# EasyEDA schematic SCH_meshkey.json
TITLE: MeshKey; REV: 1; Date: 2025-03-23; Sheet: 1/1; Drawn By: jose-d; Company: ---
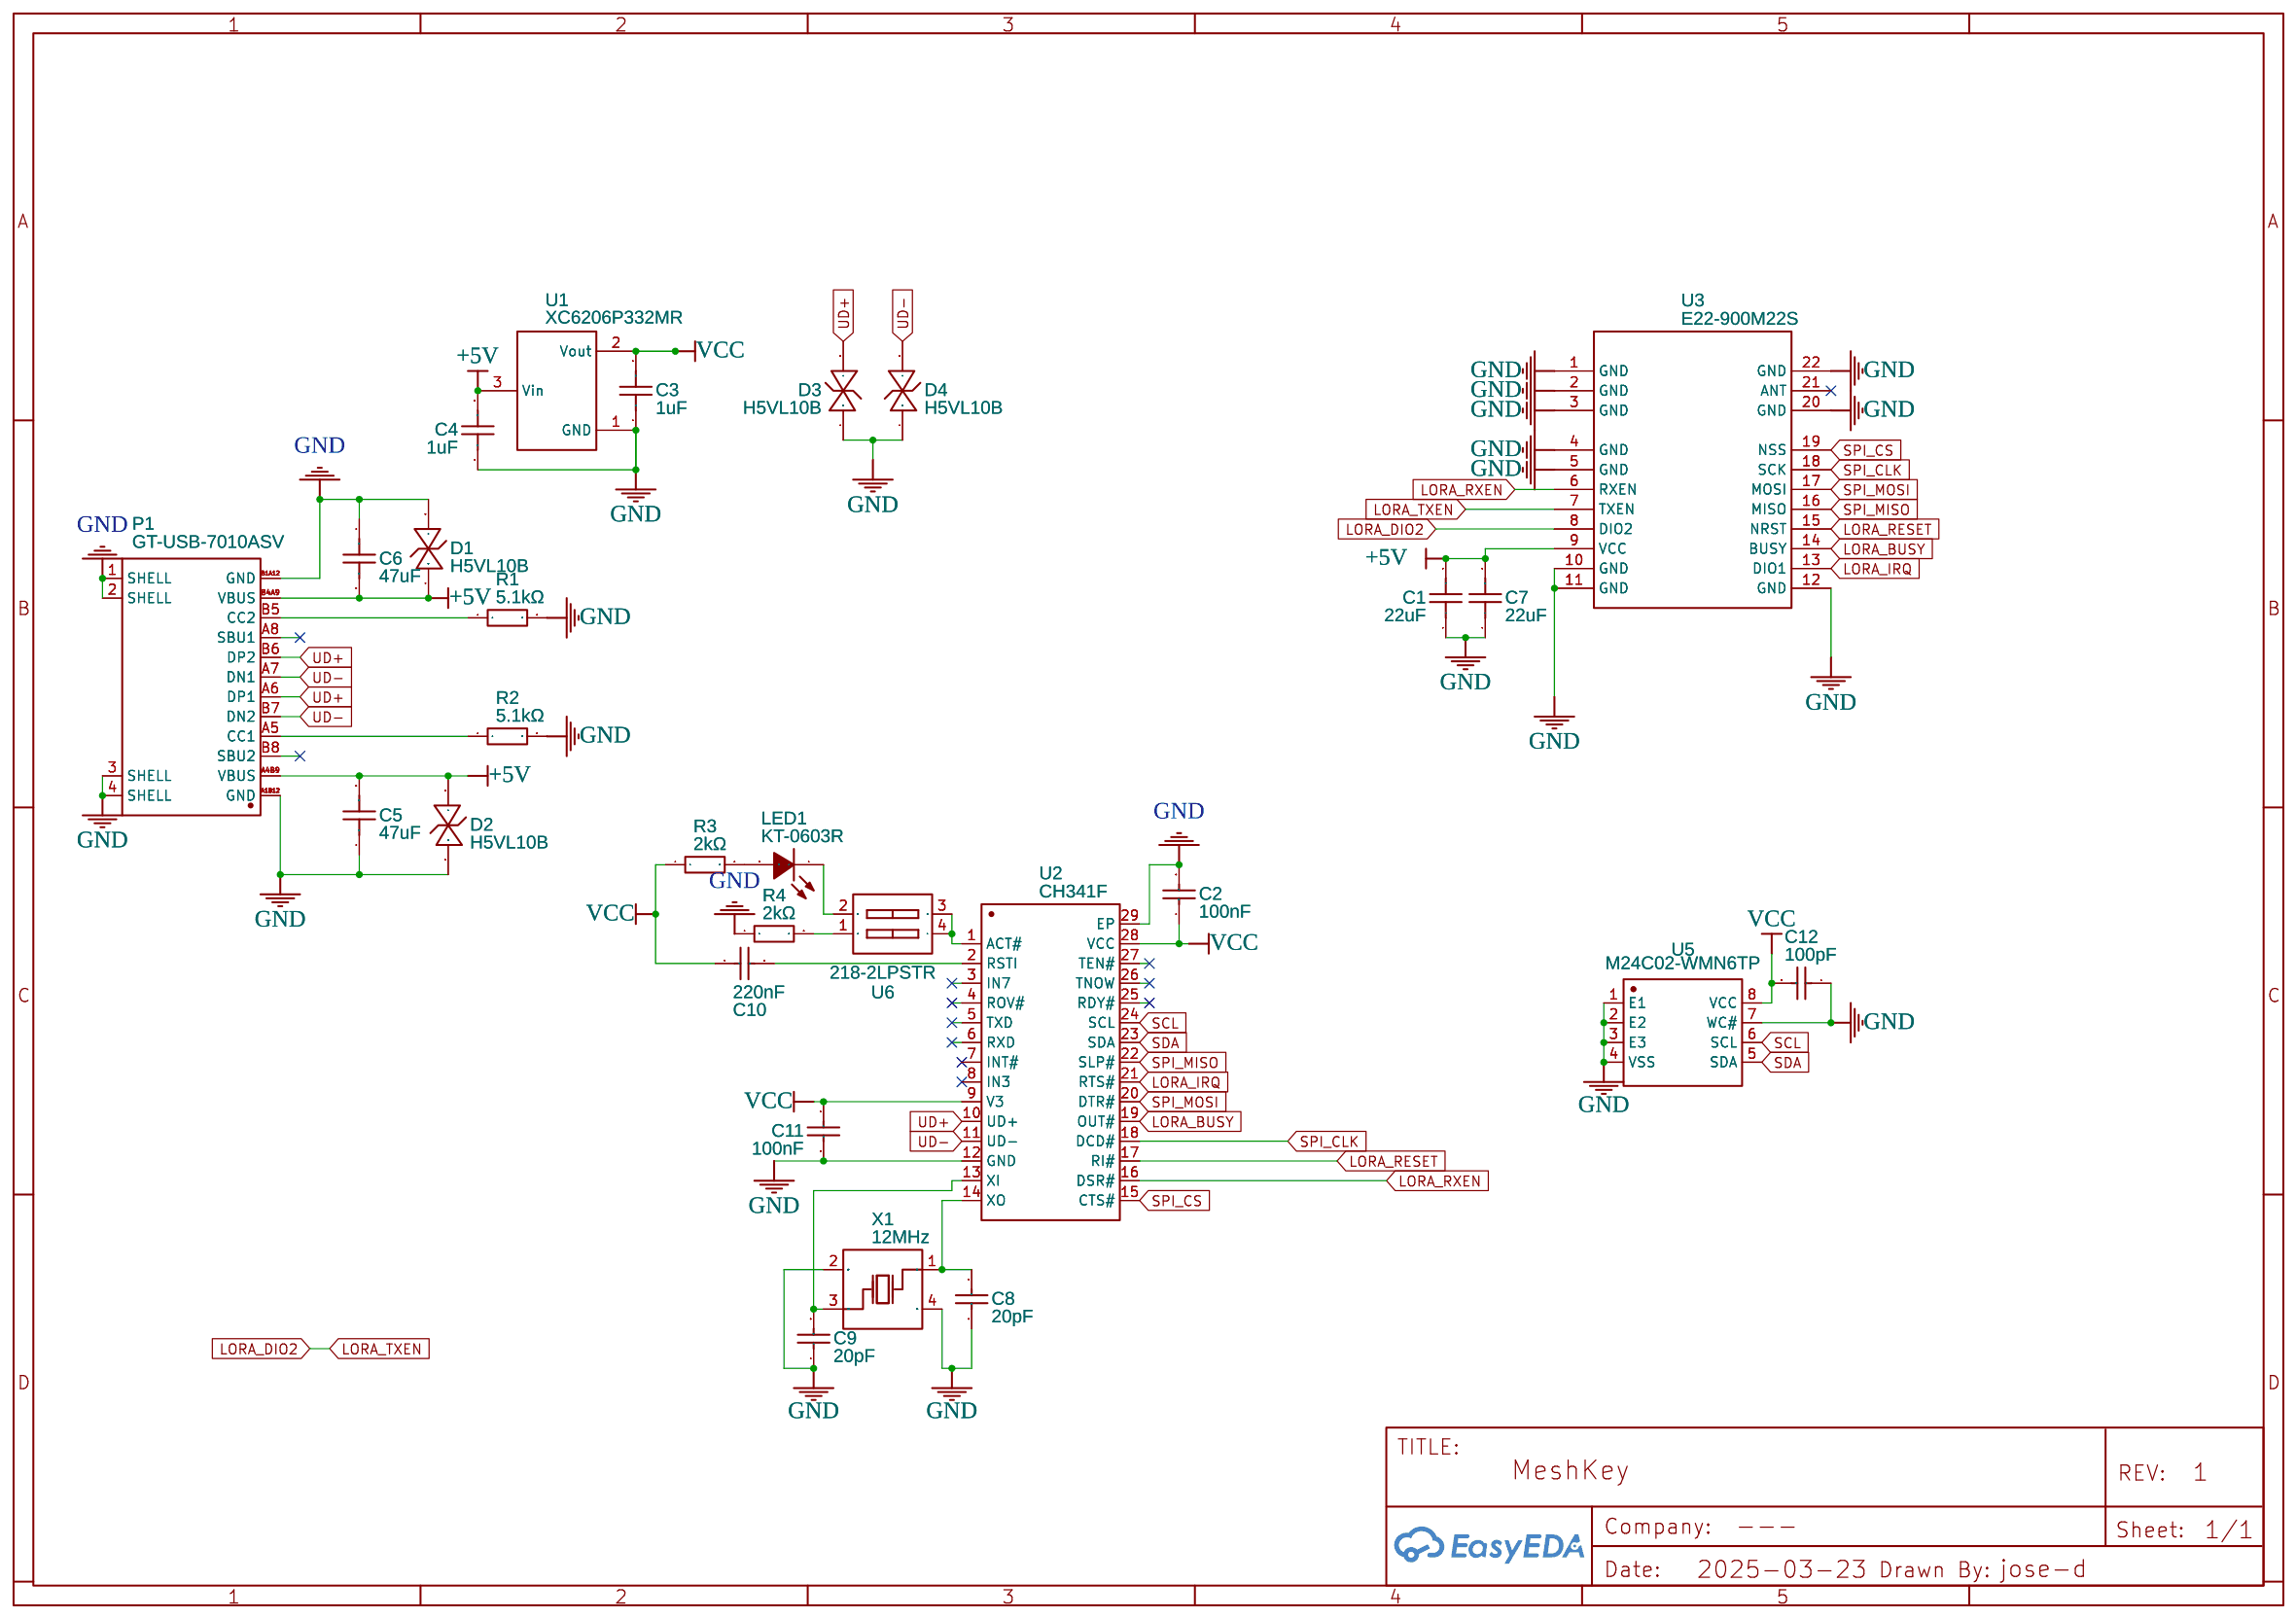
[diagram p0: schematic sheet]

## Parts
C1  22uF  [C0805]
C2  100nF  [C0402]
C3  1uF  [C0603]
C4  1uF  [C0603]
C5  47uF  [C1206]
C6  47uF  [C1206]
C7  22uF  [C0805]
C8  20pF  [C0402]
C9  20pF  [C0402]
C10  220nF  [C0402]
C11  100nF  [C0402]
C12  100pF  [C0402]
D1  H5VL10B  [SOD-882_L1.0-W0.6-BI]
D2  H5VL10B  [SOD-882_L1.0-W0.6-BI]
D3  H5VL10B  [SOD-882_L1.0-W0.6-BI]
D4  H5VL10B  [SOD-882_L1.0-W0.6-BI]
LED1  KT-0603R  [LED0603-RD]
P1  GT-USB-7010ASV  [USB-C-SMD_G-SWITCH_GT-USB-7010ASV]
R1  5.1kΩ  [R0402]
R2  5.1kΩ  [R0402]
R3  2kΩ  [R0402]
R4  2kΩ  [R0402]
U1  XC6206P332MR  [SOT-23-3_L2.9-W1.6-P1.90-LS2.8-BR]
U2  CH341F  [QFN-28_L4.0-W4.0-P0.40-BL-EP]
U3  E22-900M22S  [WIRELM-SMD_E22-900M22S]
U5  M24C02-WMN6TP  [SOIC-8_L4.9-W3.9-P1.27-LS6.0-BL]
U6  218-2LPSTR  [SW-SMD_218-2LPSTRF]
X1  12MHz  [CRYSTAL-SMD_4P-L3.2-W2.5-BL]

## Library data of the parts
C1 C7 = CL21A226MAQNNNE: Supplier: LCSC; Manufacturer: SAMSUNG(三星); Supplier Part: C45783; JLCPCB Part Class: Basic Part
C2 C11 C12 = 0402CG101J500NT: Supplier: LCSC; Manufacturer: FH(风华); Manufacturer Part: CL05B104KO5NNNC; Supplier Part: C1525; JLCPCB Part Class: Basic Part
C3 C4 = CL10A105KB8NNNC: Supplier: LCSC; Manufacturer: SAMSUNG(三星); Supplier Part: C15849; JLCPCB Part Class: Basic Part
C5 C6 = CL31A476MPHNNNE: Supplier: LCSC; Manufacturer: SAMSUNG(三星); Supplier Part: C96123; JLCPCB Part Class: Basic Part
C8 C9 = 0402CG200J500NT: Supplier: LCSC; Manufacturer: FH(风华); Supplier Part: C1554; JLCPCB Part Class: Basic Part
C10 = 0402B471K500NT: Supplier: LCSC; Manufacturer: FH(风华); Manufacturer Part: CL05B224KO5NNNC; Supplier Part: C16772; JLCPCB Part Class: Extended Part
D1-D4 = H5VL10B: Supplier: LCSC; Supplier Part: C7420372; Manufacturer: 宏迦橙; Contributor: lcsc; JLCPCB Part Class: Extended Part
LED1 = KT-0603R: Supplier: LCSC; Manufacturer: KENTO; Supplier Part: C2286; JLCPCB Part Class: Basic Part
P1 = GT-USB-7010ASV: Contributor: lcsc; Supplier: LCSC; Supplier Part: C2988369; Manufacturer: G-Switch(品赞); JLCPCB Part Class: Extended Part
R1 R2 = 0402WGF5101TCE: Supplier: LCSC; Manufacturer: UNI-ROYAL(厚声); Supplier Part: C25905; JLCPCB Part Class: Basic Part
R3 R4 = 0402WGF2001TCE: Supplier: LCSC; Manufacturer: UNI-ROYAL(厚声); Supplier Part: C4109; JLCPCB Part Class: Basic Part
U1 = XC6206P332MR: Supplier: LCSC; Manufacturer: TOREX(特瑞仕); Manufacturer Part: XC6206P332MR-G; Supplier Part: C5446; JLCPCB Part Class: Basic Part
U2 = CH341F: Contributor: LCSC; Supplier: LCSC; Supplier Part: C412870; Manufacturer: WCH(南京沁恒); JLCPCB Part Class: Extended Part
U3 = E22-900M22S: Contributor: LCSC; Supplier: LCSC; Supplier Part: C411293; Manufacturer: EBYTE(亿佰特); JLCPCB Part Class: Extended Part
U5 = M24C02-WMN6TP: Supplier: LCSC; Manufacturer: ST(意法半导体); Supplier Part: C7562; JLCPCB Part Class: Extended Part
U6 = 218-2LPSTR: Contributor: lcsc; Supplier: LCSC; Supplier Part: C2961921; Manufacturer: CTS(西迪斯); JLCPCB Part Class: Extended Part
X1 = X322512MSB4SI: Supplier: LCSC; Manufacturer: YXC(扬兴晶振); Supplier Part: C9002; JLCPCB Part Class: Basic Part

## Nets
+5V: C1.2 C4.2 C5.2 C6.2 C7.2 D1.1(C) D2.2(A) P1.A4B9(VBUS) P1.B4A9(VBUS) U1.3(Vin) U3.9(VCC)
GND: C1.1 C2.2 C3.1 C4.1 C5.1 C6.1 C7.1 C8.2 C9.1 C11.2 C12.1 D1.2(A) D2.1(C) D3.1(C) D4.1(C) P1.1(SHELL) P1.2(SHELL) P1.3(SHELL) P1.4(SHELL) P1.A1B12(GND) P1.B1A12(GND) R1.2 R2.2 R4.1 U1.1(GND) U2.12(GND) U2.29(EP) U3.1(GND) U3.2(GND) U3.3(GND) U3.4(GND) U3.5(GND) U3.10(GND) U3.11(GND) U3.12(GND) U3.20(GND) U3.22(GND) U5.1(E1) U5.2(E2) U5.3(E3) U5.4(VSS) U5.7(WC#) X1.2(GND) X1.4(GND)
VCC: C2.1 C3.2 C10.1 C11.1 C12.2 R3.1 U1.2(Vout) U2.9(V3) U2.28(VCC) U5.8(VCC)
LORA_BUSY: U2.19(OUT#) U3.14(BUSY)
LORA_DIO2: U3.7(TXEN) U3.8(DIO2)
LORA_IRQ: U2.21(RTS#) U3.13(DIO1)
LORA_RESET: U2.17(RI#) U3.15(NRST)
LORA_RXEN: U2.16(DSR#) U3.6(RXEN)
SCL: U2.24(SCL) U5.6(SCL)
SDA: U2.23(SDA) U5.5(SDA)
SPI_CLK: U2.18(DCD#) U3.18(SCK)
SPI_CS: U2.15(CTS#) U3.19(NSS)
SPI_MISO: U2.22(SLP#) U3.16(MISO)
SPI_MOSI: U2.20(DTR#) U3.17(MOSI)
UD+: D3.2(A) P1.A6(DP1) P1.B6(DP2) U2.10(UD+)
UD-: D4.2(A) P1.A7(DN1) P1.B7(DN2) U2.11(UD-)
Net-(C8-1): C8.1 U2.14(XO) X1.1(OSC1)
Net-(C9-2): C9.2 U2.13(XI) X1.3(OSC2)
Net-(C10-2): C10.2 U2.2(RSTI)
Net-(LED1-1): LED1.1(K) U6.2
Net-(LED1-2): LED1.2(A) R3.2
Net-(P1-A5): P1.A5(CC1) R2.1
Net-(P1-B5): P1.B5(CC2) R1.1
Net-(R4-2): R4.2 U6.1
Net-(U2-1): U2.1(ACT#) U6.3 U6.4

Not connected (* = marked no-connect by the designer): P1 A8(SBU1) B8(SBU2); U2 3(IN7) 4(ROV#) 5(TXD) 6(RXD) 7(INT#)* 8(IN3)* 25(RDY#) 26(TNOW) 27(TEN#); U3 21(ANT)*
